# EasyEDA Pro project ProProject_2024电赛备赛清单_Wang01_2024-08-05.epro, schematic Schematic9
Create Date: 2024-07-22; Page Name: P1; Project Name: 2024电赛备赛清单_Wang01; Schematic Name: Schematic9; Update Date: 2024-07-22; Company: 嘉立创EDA; Page Size: A4; Version: V1.0
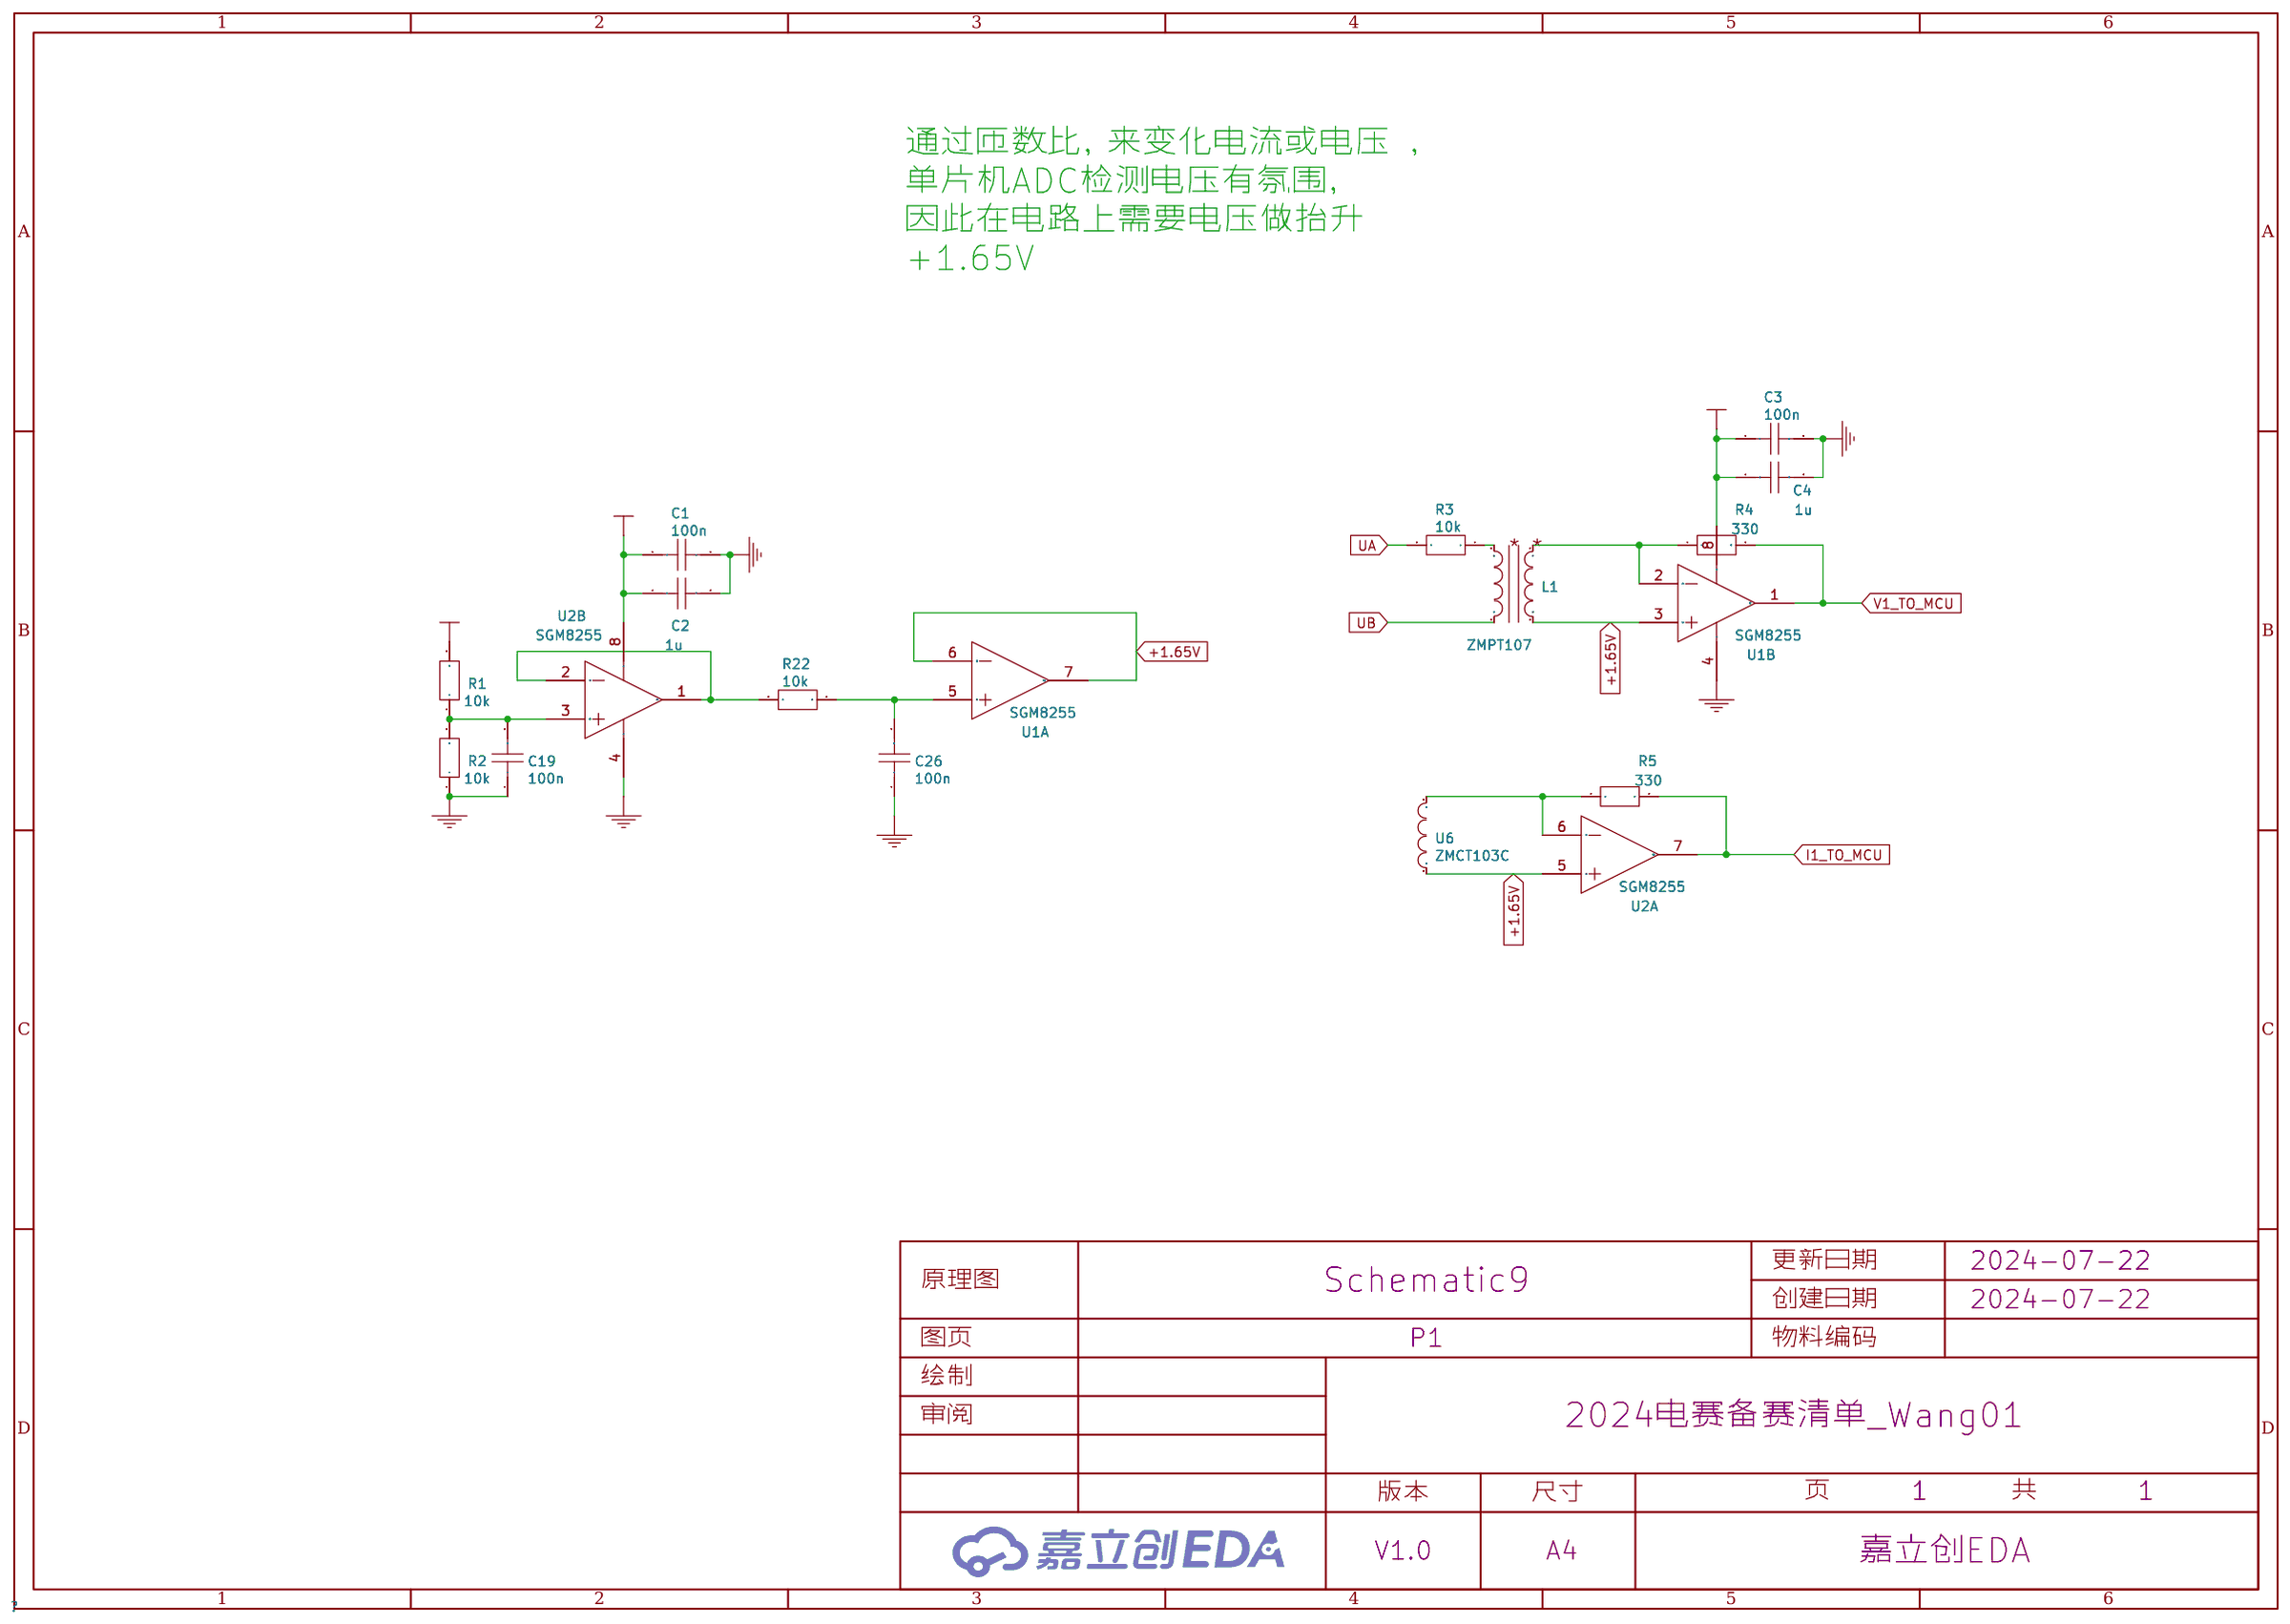
[diagram p2: schematic sheet]

## Parts
C1  100n  [C0805]
C2  1u  [C0805]
C3  100n  [C0805]
C4  1u  [C0805]
C19  100n  [CAP-TH_L4.2-W3.8-P5.08-D0.5]
C26  100n  [C0805]
L1  ZMPT107  [XFMR-TH_ZMPT107-1]
R1  10k  [R0805]
R2  10k  [R0805]
R3  10k  [R0805]
R4  330  [R0805]
R5  330  [R0805]
R22  10k  [R0805]
U1  SGM8255  [SOIC-8_L4.9-W3.9-P1.27-LS6.0-BL]  (sections 1,2)
U2  SGM8255  [SOIC-8_L4.9-W3.9-P1.27-LS6.0-BL]  (sections 1,2)
U6  ZMCT103C  [XFMR-TH_ZMCT103C]

## Library data of the parts
C1 C3 C19 C26 = 100n
C2 C4 = 1u
L1 = ZMPT107: Supplier: LCSC; Manufacturer: 南京择明; Manufacturer Part: ZMPT107-1; Supplier Part: C125191; JLCPCB Part Class: Extended Part
R1-R3 R22 = 10k
R4 R5 = 330
U1 U2 = SGM8255: Supplier: LCSC; Supplier Part: C5152163; Manufacturer: SGMICRO(圣邦微); Manufacturer Part: SGM8255B-2XS8G/TR; link: https://atta.szlcsc.com/upload/public/pdf/source/20221013/58AF3FADD83270516949D8FD0CD50EBA.pdf
U6 = ZMCT103C: Supplier: LCSC; Supplier Part: C94571; Manufacturer: 南京择明; link: https://atta.szlcsc.com/upload/public/pdf/source/20220302/0716E7B8D044EDA292B4198B83E25333.pdf; JLCPCB Part Class: Extended Part

## Nets
+1.65V: L1.2 U1.3(+INA) U1.6(-INB) U1.7(OUTB) U2.5(+INB) U6.1
+3.3V: C1.1 C2.1 C3.1 C4.1 R1.2 U1.8(V+) U2.8(V+)
DGND: C1.2 C2.2 C3.2 C4.2 C19.1 C26.1 R2.1 U1.4(V-) U2.4(V-)
V1_TO_MCU: R4.2 U1.1(OUTA)
I1_TO_MCU: R5.2 U2.7(OUTB)
UA: R3.2
UB: L1.4
Net-(C19-2): C19.2 R1.1 R2.2 U2.3(+INA)
Net-(C26-2): C26.2 R22.1 U1.5(+INB)
Net-(L1-1): L1.1 R4.1 U1.2(-INA)
Net-(L1-3): L1.3 R3.1
Net-(R5-1): R5.1 U2.6(-INB) U6.2
Net-(R22-2): R22.2 U2.1(OUTA) U2.2(-INA)

## Notes on the sheet
- 通过匝数比，来变化电流或电压 ，
  单片机ADC检测电压有氛围，
  因此在电路上需要电压做抬升
  +1.65V
